# EAGLE design Bridge (EAGLE 9.6.2)
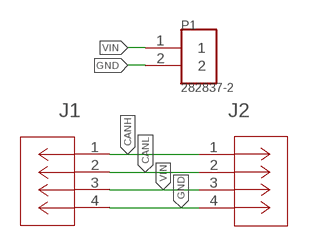
[diagram p0: schematic, sheet 1]

## Parts
J1  22027043CONN4X1_22027043_MOL  [CONN4X1_22027043_MOL]
J2  22027043CONN4X1_22027043_MOL  [CONN4X1_22027043_MOL]
P1  282837-2  [TE_282837-2]

## Nets
CANH: J1.1 J2.1
CANL: J1.2 J2.2
GND: J1.4 J2.4 P1.2
VIN: J1.3 J2.3 P1.1

## Library data of the parts
J1 J2 = 2025-02-06_19-52-32_Library:22027043; COPYRIGHT: Copyright (C) 2025 Ultra Librarian. All rights reserved.; MANUFACTURER_PART_NUMBER: 22027043; MFR_NAME: Molex Connector Corporation; TYPE: Headers, Receptacles, Female Sockets
P1 = 282837-2:282837-2: Check availability <https://pricing.snapeda.com/parts/282837-2/TE%20Connectivity/view-part?ref=eda>; AVAILABILITY: In Stock; CHECK_PRICES: https://www.snapeda.com/parts/282837-2/TE+Connectivity+AMP+Connectors/view-part/?ref=eda; COMMENT: 282837-2; DESCRIPTION: Terminal Block Connector Wire Receptacle 2 5.08 mm 30-16 AWG Green 13.5 A 250 V | TE Connectivity 282837-2; MF: TE Connectivity; MP: 282837-2; PACKAGE: None; PRICE: None; SNAPEDA_LINK: https://www.snapeda.com/parts/282837-2/TE+Connectivity+AMP+Connectors/view-part/?ref=snap

## Board
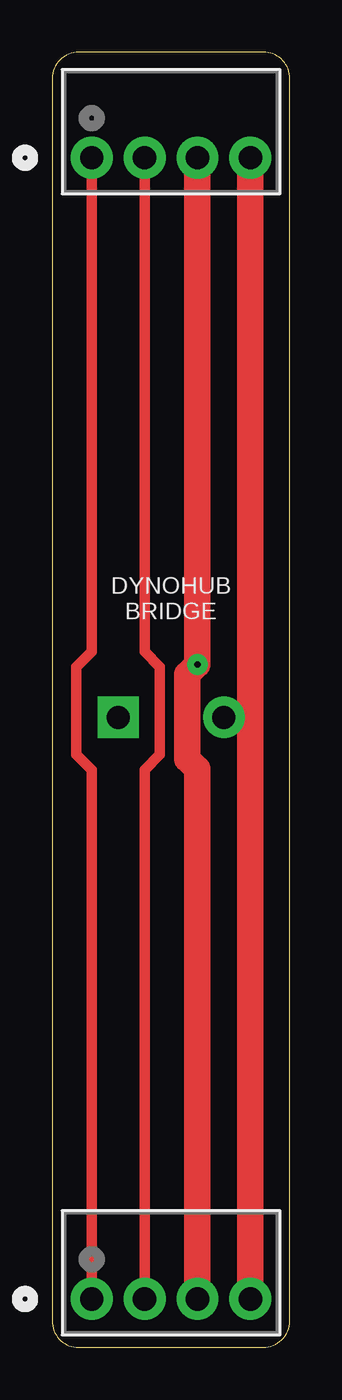
[diagram p1: board, top side]
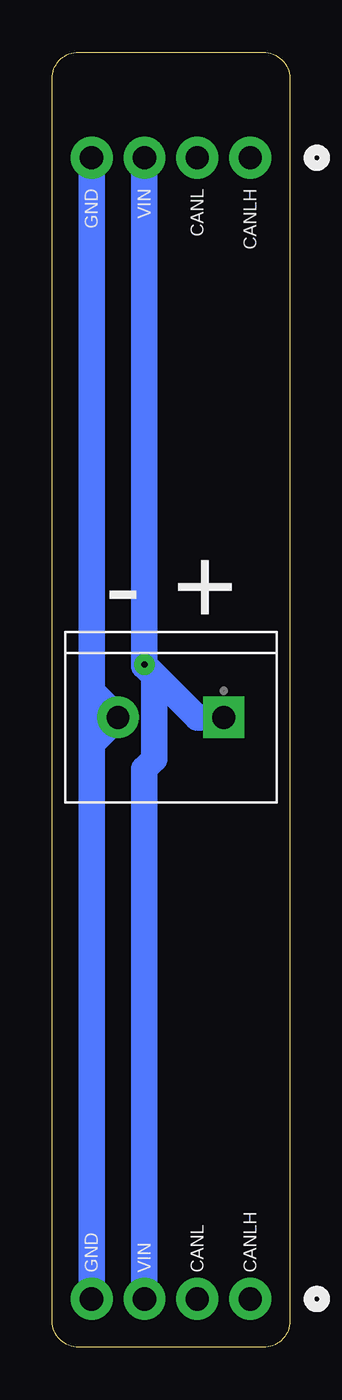
[diagram p2: board, bottom side, seen from below]

Size 11.42 x 62.23 mm. Coordinates in mm from the lower left corner, seen from the top.
Outline: 0.01,60.96 0,1.27 arc90 1.27,0 10.14,0 arc90 11.41,1.27 11.42,60.96 arc90 10.15,62.23 1.28,62.23 arc90 0.01,60.96
Copper layers (1*16): Top 0.035mm / dielectric 1.6mm / Bottom 0.035mm
Design rules "jlcpcb-2layers": minimum track width 5mil, minimum drill 0.3mm, track to track 5mil, track to pad 5mil, pad to pad 5mil, via to via 5mil, smd to smd 5mil, copper to edge 0.2mm, drill to drill 6mil, minimum pad ring 10mil, minimum via ring 3mil, stop-mask expansion 4mil, vias tented up to drill 0mil, thermal gap 10mil

### Footprints (pad centres in the part's own frame; a part is rotated, then mirrored left to right if it is on the bottom)
CONN4X1_22027043_MOL = drill 1.118 pad 1.626: 1 0,0; 2 2.54,0; 3 5.08,0; 4 7.62,0
TE_282837-2 = drill 1.1 square: 1 -2.54,0 | drill 1.1: 2 2.54,0

### Placement (x,y rotation side)
J1  1.9,2.33 0 top
J2  1.9,57.15 0 top
P1  5.71,30.27 180 bottom

### Tracks (layer width: path | path; a pad name or v marks a point on that pad's centre or on a via)
CANH
  Top 0.508: J1.1 1.9,27.75 1.17,28.49 1.17,32.69 1.9,33.42 J2.1
CANL
  Top 0.508: J2.2 4.44,33.42 5.18,32.69 5.18,28.49 4.44,27.75 J1.2
GND
  Top 1.27: J2.4 J1.4
  Bottom 1.27: J1.4 9.52,29 | 9.52,29 9.52,31.54 | 9.52,31.54 P1.2 9.52,29 | J2.4 9.52,31.54
VIN  (via drill 0.3 pad 1)
  Top 1.27: J2.3 v6.98,32.81 6.5,32.33 6.5,28.27 6.98,27.79 J1.3
  Bottom 1.27: v6.98,32.81 4.44,30.27 P1.1 | v6.98,32.81 6.98,32.75 6.5,32.27 6.5,28.27 6.98,27.79 J1.3 | J2.3 v6.98,32.81

### Text on the board
tPlace: DYNOHUB / BRIDGE
bNames: CANLH | CANL | VIN | GND | - + | CANLH | CANL | VIN | GND